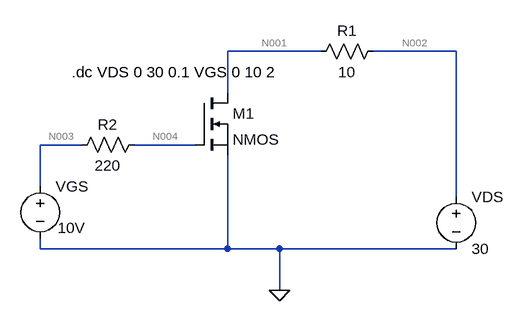
[diagram p0: schematic Draft1.asc]
Draft1.asc, the LTspice schematic file:
Version 4
SHEET 1 880 680
WIRE 176 -240 32 -240
WIRE 384 -240 256 -240
WIRE 32 -176 32 -240
WIRE -192 -96 -256 -96
WIRE -16 -96 -112 -96
WIRE -256 -32 -256 -96
WIRE 384 -16 384 -240
WIRE -256 64 -256 48
WIRE 32 64 32 -80
WIRE 32 64 -256 64
WIRE 112 64 32 64
WIRE 384 64 112 64
WIRE 112 128 112 64
FLAG 112 128 0
SYMBOL res -96 -112 R90
WINDOW 0 0 56 VBottom 2
WINDOW 3 32 56 VTop 2
SYMATTR InstName R2
SYMATTR Value 220
SYMBOL res 272 -256 R90
WINDOW 0 0 56 VBottom 2
WINDOW 3 32 56 VTop 2
SYMATTR InstName R1
SYMATTR Value 10
SYMBOL nmos -16 -176 R0
SYMATTR InstName M1
SYMBOL voltage -256 -48 R0
WINDOW 3 27 80 Left 2
WINDOW 123 0 0 Left 0
WINDOW 39 0 0 Left 0
SYMATTR Value 10V
SYMATTR InstName VGS
SYMBOL voltage 384 -32 R0
WINDOW 123 0 0 Left 0
WINDOW 39 0 0 Left 0
SYMATTR InstName VDS
SYMATTR Value 30
TEXT -208 -208 Left 2 !.dc VDS 0 30 0.1 VGS 0 10 2

The netlist it stands for:
* Draft1.asc
R2 N004 N003 220
R1 N002 N001 10
M1 N001 N004 0 0 NMOS
VGS N003 0 10V
VDS N002 0 30
.model NMOS NMOS
.model PMOS PMOS
.lib standard.mos
.dc VDS 0 30 0.1 VGS 0 10 2
.backanno
.end

* Results of the author's LTspice run, read from the files saved beside the schematic
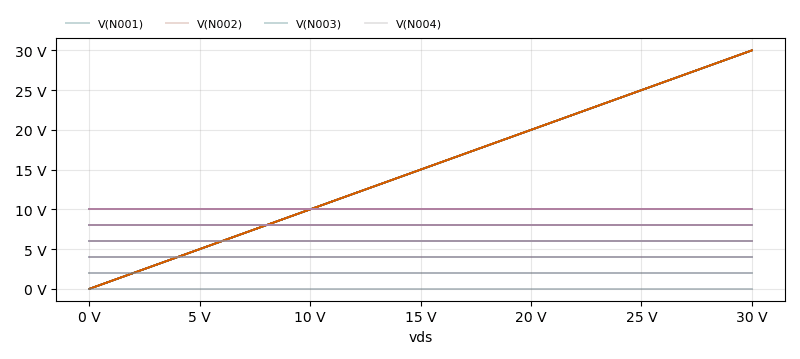
[diagram p1: DC transfer characteristic of Draft1.asc, plotted from the saved traces]
* DC transfer characteristic, 6 runs:
*   V(N001) [vgs=0]: 0 V at vds=0 V, 30 V at vds=30 V, min 0 V, max 30 V
*   V(N001) [vgs=2]: -4.851e-16 fV at vds=0 V, 30 V at vds=30 V, min -4.851e-16 fV, max 30 V
*   V(N001) [vgs=4]: -5.08e-16 fV at vds=0 V, 30 V at vds=30 V, min -5.08e-16 fV, max 30 V
*   V(N001) [vgs=6]: -9.243e-13 fV at vds=0 V, 30 V at vds=30 V, min -9.243e-13 fV, max 30 V
*   V(N001) [vgs=8]: 0 V at vds=0 V, 29.99 V at vds=30 V, min 0 V, max 29.99 V
*   V(N001) [vgs=10]: 0 V at vds=0 V, 29.99 V at vds=30 V, min 0 V, max 29.99 V
*   V(N002) [vgs=0]: 0 V at vds=0 V, 30 V at vds=30 V, min 0 V, max 30 V
*   V(N002) [vgs=2]: 0 V at vds=0 V, 30 V at vds=30 V, min 0 V, max 30 V
*   V(N002) [vgs=4]: 0 V at vds=0 V, 30 V at vds=30 V, min 0 V, max 30 V
*   V(N002) [vgs=6]: 0 V at vds=0 V, 30 V at vds=30 V, min 0 V, max 30 V
*   V(N002) [vgs=8]: 0 V at vds=0 V, 30 V at vds=30 V, min 0 V, max 30 V
*   V(N002) [vgs=10]: 0 V at vds=0 V, 30 V at vds=30 V, min 0 V, max 30 V
*   V(N003) [vgs=0]: 0 V at vds=0 V, 0 V at vds=30 V, min 0 V, max 0 V
*   V(N003) [vgs=2]: 2 V at vds=0 V, 2 V at vds=30 V, min 2 V, max 2 V
*   V(N003) [vgs=4]: 4 V at vds=0 V, 4 V at vds=30 V, min 4 V, max 4 V
*   V(N003) [vgs=6]: 6 V at vds=0 V, 6 V at vds=30 V, min 6 V, max 6 V
*   V(N003) [vgs=8]: 8 V at vds=0 V, 8 V at vds=30 V, min 8 V, max 8 V
*   V(N003) [vgs=10]: 10 V at vds=0 V, 10 V at vds=30 V, min 10 V, max 10 V
*   V(N004) [vgs=0]: 0 V at vds=0 V, 0 V at vds=30 V, min 0 V, max 0 V
*   V(N004) [vgs=2]: 2 V at vds=0 V, 2 V at vds=30 V, min 2 V, max 2 V
*   V(N004) [vgs=4]: 4 V at vds=0 V, 4 V at vds=30 V, min 4 V, max 4 V
*   V(N004) [vgs=6]: 6 V at vds=0 V, 6 V at vds=30 V, min 6 V, max 6 V
*   V(N004) [vgs=8]: 8 V at vds=0 V, 8 V at vds=30 V, min 8 V, max 8 V
*   V(N004) [vgs=10]: 10 V at vds=0 V, 10 V at vds=30 V, min 10 V, max 10 V